# EAGLE design dynext_v1.1 (EAGLE 6.5.0)
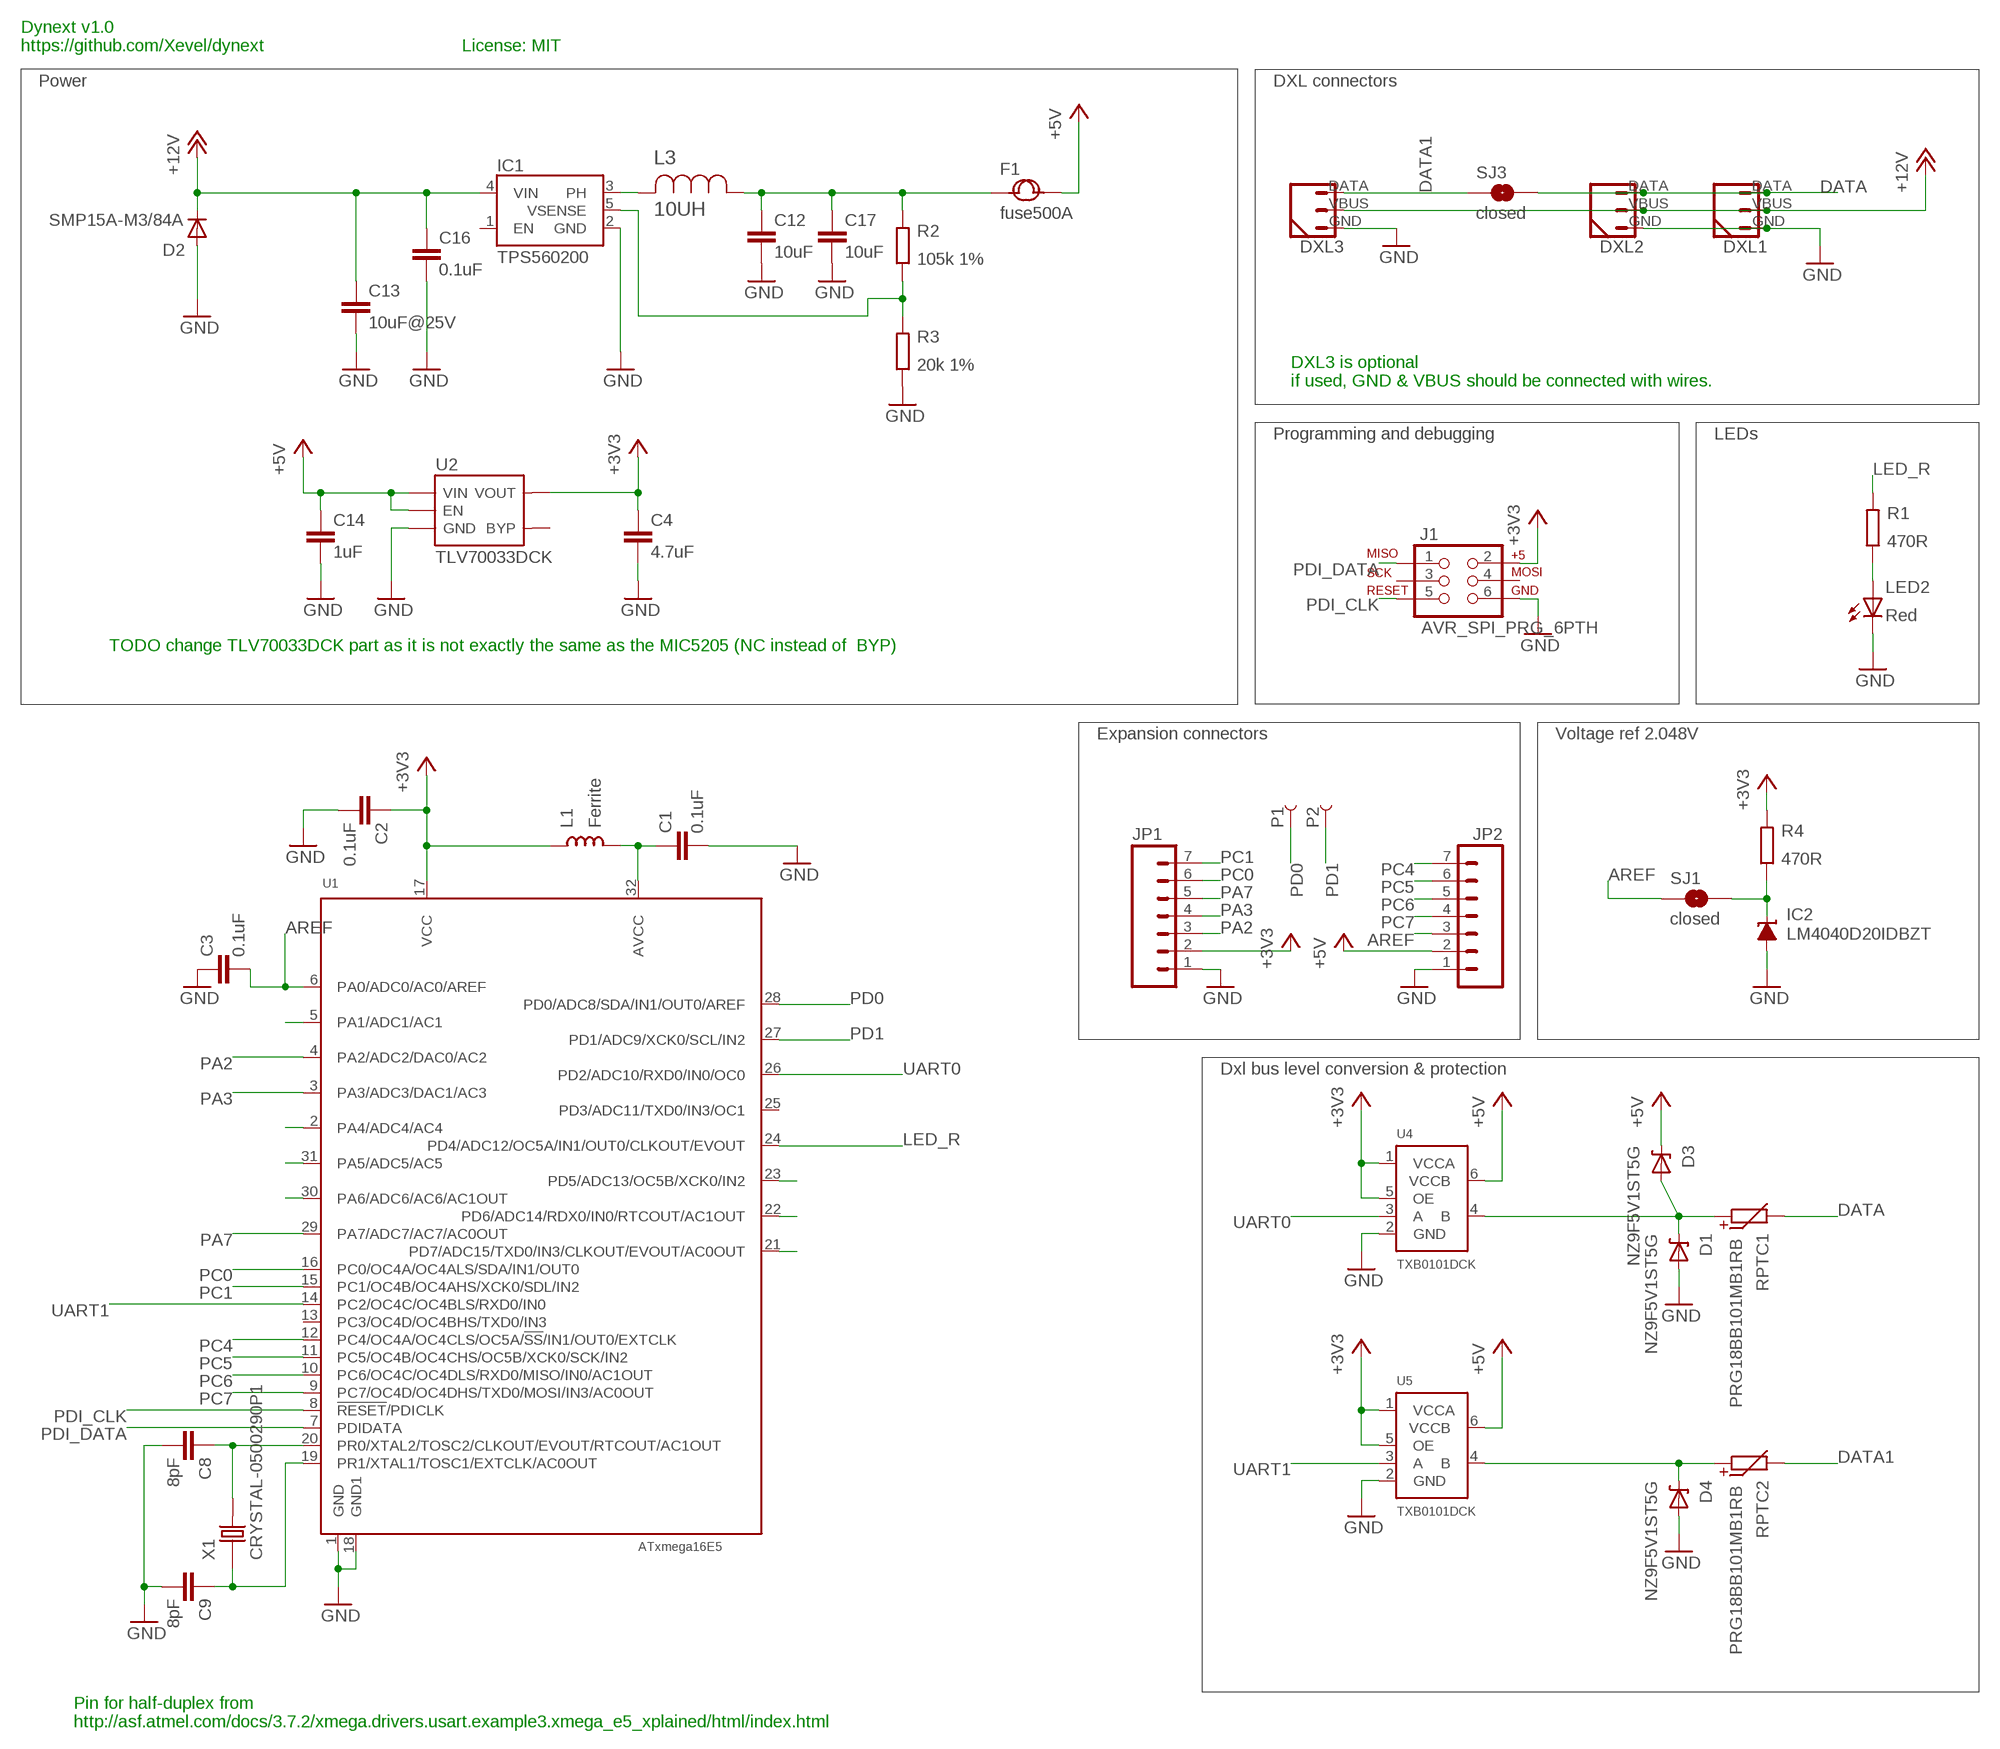
[diagram p0: schematic, sheet 1]

## Parts
C1  0.1uF  C0402  [0402_N]
C2  0.1uF  C0402  [0402_N]
C3  0.1uF  C0402  [0402_N]
C4  4.7uF  C0603  [0603_N]
C8  8pF  C0402  [0402_N]
C9  8pF  C0402  [0402_N]
C12  10uF  C0805  [0805_N]
C13  10uF@25V  C0805  [0805_N]
C14  1uF  C0402  [0402_N]
C16  0.1uF  C0402  [0402_N]
C17  10uF  C0805  [0805_N]
D1  NZ9F5V1ST5G  DIODE_ZENER-923  [SOD-923_N]
D2  SMP15A-M3/84A  DIODE-SMP  [DO-220AA]
D3  NZ9F5V1ST5G  DIODE_ZENER-923  [SOD-923_N]
D4  NZ9F5V1ST5G  DIODE_ZENER-923  [SOD-923_N]
DXL1  DYNAMIXEL_3POS-T  [DYNAMIXEL_3POS_TOP]
DXL2  DYNAMIXEL_3POS-T  [DYNAMIXEL_3POS_TOP]
DXL3  DYNAMIXEL_3POS-R  [DYNAMIXEL_3POS_RIGHT]
F1  fuse500A  FUSE-1206  [F1206]
IC1  TPS560200  IC_TPS560200  [SOT-23-5_N]
IC2  LM4040D20IDBZT  LM4041A12DBZ  [DBZ_R-PDSO-G3]
J1  AVR_SPI_PRG_6PTH  [2X3]
JP1  M07  [1X07]
JP2  M07  [1X07]
L1  Ferrite  L0603  [0603_N]
L3  10UH  ELL4LG100MA-4XG  [IND_ELL4XG]
LED2  Red  LED0603  [D_0603_N]
P1  PIN_SMD_2X2.5  [PIN_SMD_2X2.5]
P2  PIN_SMD_2X2.5  [PIN_SMD_2X2.5]
R1  470R  R0402  [0402_N]
R2  105k 1%  R0402  [0402_N]
R3  20k 1%  R0402  [0402_N]
R4  470R  R0402  [0402_N]
RPTC1  PRG18BB101MB1RB  R-PTC0603  [0603_N]
RPTC2  PRG18BB101MB1RB  R-PTC0603  [0603_N]
SJ1  closed  SOLDERJUMPER2_TRACE2  [SJ_2S-TRACE2]
SJ3  closed  SOLDERJUMPER2_TRACE2  [SJ_2S-TRACE2]
U1  ATxmega16E5  ATXMEGAE5-MU_MOD  [QFN-32_50P_L_MOD]
U2  TLV70033DCK  MIC5205-3.3YM5  [SC70-5]
U4  TXB0101DCK  [SC70-6]
U5  TXB0101DCK  [SC70-6]
X1  CRYSTAL-0500290P1  [2P-SMD-5.0X3.2]

## Nets
+3V3: C2.1 C4.1 J1.2 JP1.2 L1.1 R4.2 U1.17(VCC) U2.5(VOUT) U4.1(VCCA) U4.5(OE) U5.1(VCCA) U5.5(OE)
+5V: C14.1 D3.C F1.2 JP2.2 U2.1(VIN) U2.3(EN) U4.6(VCCB) U5.6(VCCB)
+12V: C13.1 C16.1 D2.C DXL1.VBUS DXL2.VBUS DXL3.VBUS IC1.4(VIN)
AREF: C3.2 JP2.3 SJ1.1 U1.6(PA0/ADC0/AC0/AREF)
DATA: DXL1.DATA DXL2.DATA RPTC1.2 SJ3.2
DATA1: DXL3.DATA RPTC2.2 SJ3.1
GND: C1.2 C2.2 C3.1 C4.2 C8.2 C9.2 C12.2 C13.2 C14.2 C16.2 C17.2 D1.A D2.A D4.A DXL1.GND DXL2.GND DXL3.GND IC1.2(GND) IC2.2(A) J1.6 JP1.1 JP2.1 LED2.C R3.1 U1.1(GND) U1.18(GND1) U2.2(GND) U4.2(GND) U5.2(GND)
LED_R: R1.2 U1.24(PD4/ADC12/OC5A/IN1/OUT0/CLKOUT/EVOUT)
N$2: C1.1 L1.2 U1.32(AVCC)
N$3: LED2.A R1.1
N$4: C8.1 U1.20(PR0/XTAL2/TOSC2/CLKOUT/EVOUT/RTCOUT/AC1OUT) X1.2
N$6: C9.1 U1.19(PR1/XTAL1/TOSC1/EXTCLK/AC0OUT) X1.1
N$7: D1.C D3.A RPTC1.1 U4.4(B)
N$8: U1.5(PA1/ADC1/AC1)
N$9: U1.2(PA4/ADC4/AC4)
N$10: U1.31(PA5/ADC5/AC5)
N$11: D4.C RPTC2.1 U5.4(B)
N$12: U1.30(PA6/ADC6/AC6/AC1OUT)
N$13: U1.21(PD7/ADC15/TXD0/IN3/CLKOUT/EVOUT/AC0OUT)
N$14: C12.1 C17.1 F1.1 L3.1 R2.2
N$15: IC1.5(VSENSE) R2.1 R3.2
N$16: U1.22(PD6/ADC14/RDX0/IN0/RTCOUT/AC1OUT)
N$17: U1.23(PD5/ADC13/OC5B/XCK0/IN2)
N$29: IC2.1(C) R4.1 SJ1.2
PA2: JP1.3 U1.4(PA2/ADC2/DAC0/AC2)
PA3: JP1.4 U1.3(PA3/ADC3/DAC1/AC3)
PA7: JP1.5 U1.29(PA7/ADC7/AC7/AC0OUT)
PC0: JP1.6 U1.16(PC0/OC4A/OC4ALS/SDA/IN1/OUT0)
PC1: JP1.7 U1.15(PC1/OC4B/OC4AHS/XCK0/SDL/IN2)
PC4: JP2.7 U1.12(PC4/OC4A/OC4CLS/OC5A/!SS!/IN1/OUT0/EXTCLK)
PC5: JP2.6 U1.11(PC5/OC4B/OC4CHS/OC5B/XCK0/SCK/IN2)
PC6: JP2.5 U1.10(PC6/OC4C/OC4DLS/RXD0/MISO/IN0/AC1OUT)
PC7: JP2.4 U1.9(PC7/OC4D/OC4DHS/TXD0/MOSI/IN3/AC0OUT)
PD0: P1.PIN U1.28(PD0/ADC8/SDA/IN1/OUT0/AREF)
PD1: P2.PIN U1.27(PD1/ADC9/XCK0/SCL/IN2)
PDI_CLK: J1.5 U1.8(!RESET!/PDICLK)
PDI_DATA: J1.1 U1.7(PDIDATA)
PH_L: IC1.3(PH) L3.2
UART0: U1.26(PD2/ADC10/RXD0/IN0/OC0) U4.3(A)
UART1: U1.14(PC2/OC4C/OC4BLS/RXD0/IN0) U5.3(A)
Unconnected: IC1.1(EN) J1.3 J1.4 U1.13(PC3/OC4D/OC4BHS/TXD0/IN3) U1.25(PD3/ADC11/TXD0/IN3/OC1) U2.4(BYP)

## Notes on the sheet
- Dynext v1.0
  https://github.com/Xevel/dynext
- License: MIT
- Power | DXL connectors
- DXL3 is optional 
  if used, GND & VBUS should be connected with wires.
- Programming and debugging | LEDs
- TODO change TLV70033DCK part as it is not exactly the same as the MIC5205 (NC instead of  BYP)
- Expansion connectors | Voltage ref 2.048V
- Dxl bus level conversion & protection
- Pin for half-duplex from 
  http://asf.atmel.com/docs/3.7.2/xmega.drivers.usart.example3.xmega_e5_xplained/html/index.html

## Library data of the parts
C1-C4 C8 C9 C12-C14 C16 C17 = Xevelabs:C: Non-polarized Capacitor
D1 D3 D4 = Xevelabs:DIODE_ZENER: Zener Diode
D2 = Xevelabs:DIODE: Diode
DXL1-DXL3 = Xevelabs:DYNAMIXEL_3POS
F1 = OPL:FUSE*
IC1 = Xevelabs:IC_TPS560200
IC2 = texas:LM4041: PRECISION MICROPOWER SHUNT VOLTAGE REFERENCE Source: http://focus.ti.com/lit/ds/slcs146e/slcs146e.pdf; MPN: LM4041A12IDBZR; OC_FARNELL: 1407949; OC_NEWARK: 58K5875
J1 = SparkFun-Connectors:AVR_SPI_PRG_6: AVR ISP 6 Pin This is the reduced ISP connector for AVR programming. Common on Arduino. This footprint will take up less PCB space and can be used with a 10-pin to 6-pin adapter such as SKU: BOB-08508
JP1 JP2 = SparkFun-Connectors:M07: Header 7 Standard 7-pin 0.1" header. Use with straight break away headers (SKU : PRT-00116), right angle break away headers (PRT-00553), swiss pins (PRT-00743), machine pins (PRT-00117), and female headers (PRT-00115). NOTES ON THE VARIANTS LOCK and LOCK_LONGPADS... This footprint was designed to help hold the alignment of a through-hole component (i.e. 7-pin header) while soldering it into place. You may notice that each hole has been shifted either up or down by 0.005 of an inch from it's more standard position (which is usually a perfectly straight line). This slight alteration caused the pins (the squares in the middle) to touch the edges of the holes. Because they are alternating, it causes a "brace" to hold the header in place. 0.005 has proven to be the perfect amount of "off-center" position when using our standard breakaway headers. Although looks a little odd when you look at the bare footprint, once you have a header in there, the alteration is very hard to notice. Also, if you push a header all the way into place, it is covered up entirely on the bottom side. This idea of altering the position of holes to aid alignment will be further integrated into the Sparkfun Library for other footprints. It can help hold any component with 3 or more connection pins.
L1 = Xevelabs:L
L3 = Panasonic-ELL:ELL: Choke Coils; MPN: ELL4LG100MA; OC_FARNELL: 1717444; OC_NEWARK: 15R1065; PACKAGE-SIZE: 3.8X3.8X1.8MM; SUPPLIER: PANASONIC
LED2 = Xevelabs:LED: LED
P1 P2 = Xevelabs:PIN
R1-R4 = Xevelabs:R: Resistor
RPTC1 RPTC2 = Xevelabs:R-PTC: PTC (Positive Temperature Coefficient) Resistor
SJ1 SJ3 = Xevelabs:SOLDERJUMPER2: Solder Jumper Standard SMD solder jumper. Used to automate production. Two varients : Normally Open and Normally Closed are the same, but have different paste layers. NC will have a large amount of paste and should jumper during reflow.
U1 = dynext_v0.1:ATXMEGAE5
U2 = OPL:MIC5205-3.3YM5: The MIC5205 is an efficient linear voltage regulator with ultra-low-noise output, very low dropout voltage (typically 17mV at light loads and 165mV at 150mA), and very low ground current (600µA at 100mA output). The MIC5205 offers better than 1% initial accuracy. datasheet here: http://www.micrel.com/product-info/prod/5205.shtml
U4 U5 = MWquad_stuff:TXB0101
X1 = OPL:CRYSTAL*

## Board
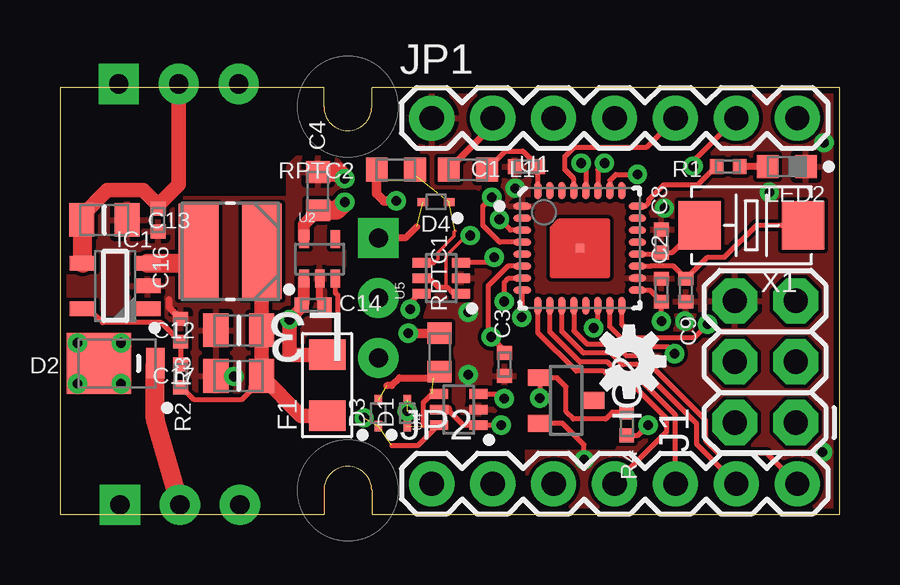
[diagram p1: board, top side]
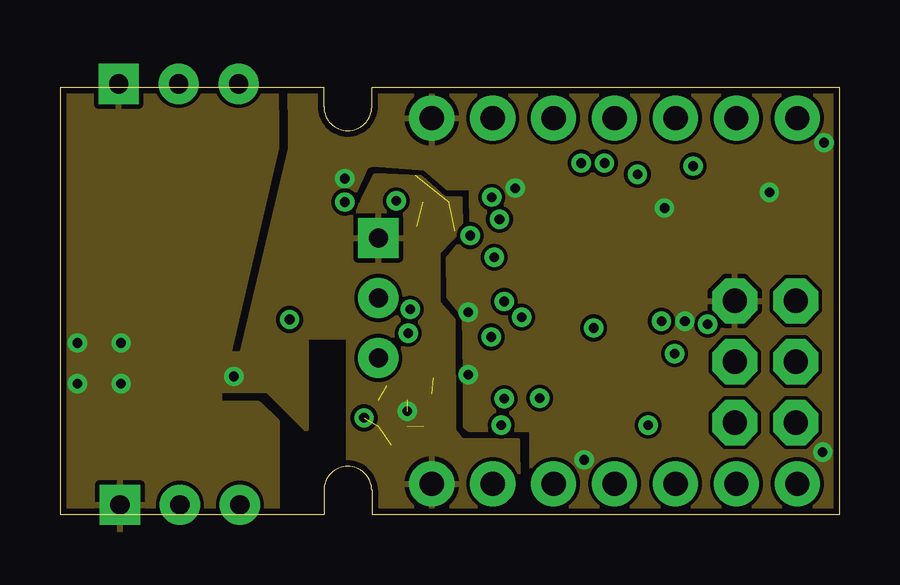
[diagram p2: board, inner layer GND]
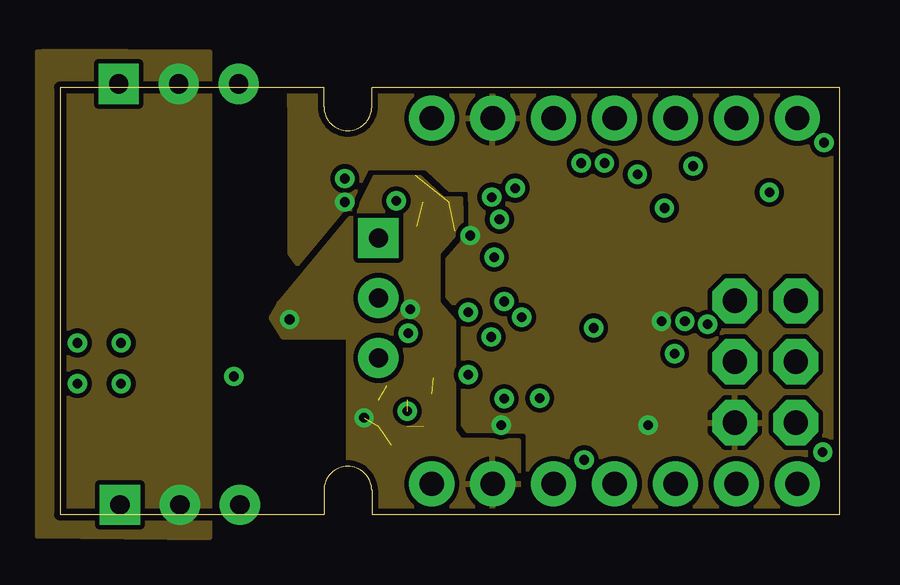
[diagram p3: board, inner layer POWER]
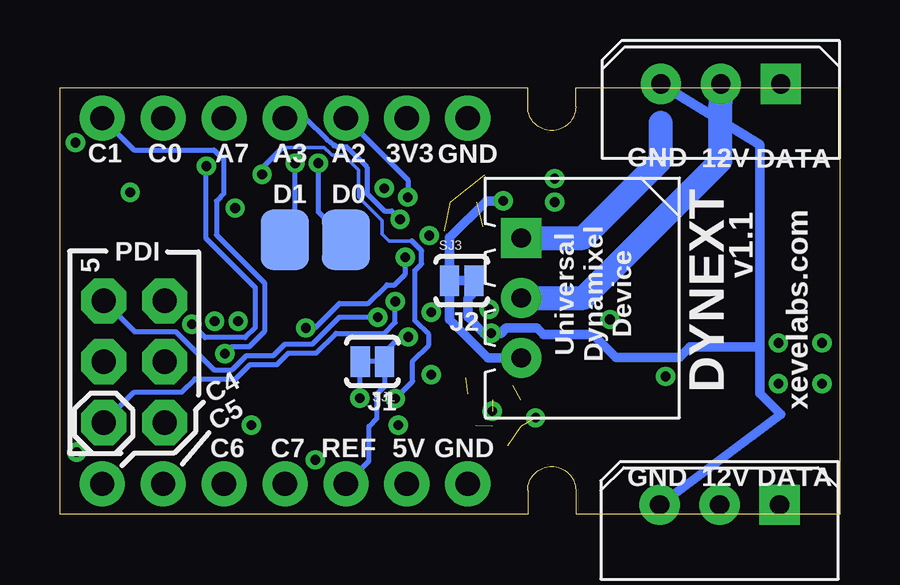
[diagram p4: board, bottom side, seen from below]

Size 32.5 x 17.8 mm. Coordinates in mm from the lower left corner, seen from the top.
Outline: 0,0 11,0 11,1 arc-180 13,1 13,0 32.5,0 32.5,17.8 13,17.8 13,17 arc-180 11,17 11,17.8 0,17.8 0,0
Copper layers (1*2*3*16): Top 0.035mm / dielectric 0.15mm / GND 0.035mm / dielectric 1.1mm / POWER 0.035mm / dielectric 0.15mm / Bottom 0.035mm
Design rules "Xevelabs_6mil_4layers_eurocircuits *": minimum track width 0.15mm, minimum drill 0.25mm, track to track 0.155mm, track to pad 0.155mm, pad to pad 0.155mm, via to via 0.155mm, smd to smd 0mil, copper to edge 0.25mm, drill to drill 0.25mm, minimum pad ring 0.15mm, minimum via ring 0.2mm, stop-mask expansion 0mil, vias tented up to drill 100mil, thermal gap 0.2mm
tRestrict: area 19.1,2.8 to 23.1,6.7

### Footprints (pad centres in the part's own frame; a part is rotated, then mirrored left to right if it is on the bottom)
0402_N = smd 0.57 x 0.62: 1 -0.48,0; 2 0.48,0
0603_N = smd 0.9 x 1: 1 -0.8,0; 2 0.8,0
0805_N = smd 1.05 x 1.4: 1 -0.95,0; 2 0.95,0
SOD-923_N = smd 0.43 x 0.32: A 0.55,0; C -0.55,0
DO-220AA = smd 2.67 x 2.54: A 0.7,0 | smd 0.76 x 1.27: C -1.65,0
DYNAMIXEL_3POS_TOP = drill 0.8 pad 1.676: DATA 0,-5; VBUS 0,-2.5 | drill 0.8 pad 1.676 square: GND 0,0
DYNAMIXEL_3POS_RIGHT = drill 0.8 pad 1.676: DATA 0,-5; VBUS 0,-2.5 | drill 0.8 pad 1.676 square: GND 0,0
F1206 = smd 1.27 x 1.524: 1 -1.27,0; 2 1.27,0
SOT-23-5_N = smd 1.1 x 0.6: 1 -1.35,0.95; 2 -1.35,0; 3 -1.35,-0.95; 4 1.35,-0.95; 5 1.35,0.95
DBZ_R-PDSO-G3 = smd 0.7 x 1: 1 -0.95,-1.1; 2 0.95,-1.1; 3 0,1.1
2X3 = drill 1.016 pad 1.88 octagon: 1 0,0; 2 0,2.54; 3 2.54,0; 4 2.54,2.54; 5 5.08,0; 6 5.08,2.54
1X07 = drill 1.016 pad 1.88: 1 0,0; 2 2.54,0; 3 5.08,0; 4 7.62,0; 5 10.16,0; 6 12.7,0; 7 15.24,0
IND_ELL4XG = smd 1.651 x 3.988: 1 -1.321,0; 2 1.321,0
D_0603_N = smd 0.9 x 0.95: A 0.8,0; C -0.8,0
PIN_SMD_2X2.5 = smd 2.5 x 2: PIN 0,0
SJ_2S-TRACE2 = smd 0.8 x 1.27: 1 -0.508,0; 2 0.508,0
QFN-32_50P_L_MOD = smd 0.75 x 0.3: 1 -2.4,1.75; 2 -2.4,1.25; 3 -2.4,0.75; 4 -2.4,0.25; 5 -2.4,-0.25; 6 -2.4,-0.75; 7 -2.4,-1.25; 8 -2.4,-1.75; 17 2.4,-1.75; 18 2.4,-1.25; 19 2.4,-0.75; 20 2.4,-0.25; 21 2.4,0.25; 22 2.4,0.75; 23 2.4,1.25; 24 2.4,1.75 | smd 0.3 x 0.75: 9 -1.75,-2.4; 10 -1.25,-2.4; 11 -0.75,-2.4; 12 -0.25,-2.4; 13 0.25,-2.4; 14 0.75,-2.4; 15 1.25,-2.4; 16 1.75,-2.4; 25 1.75,2.4; 26 1.25,2.4; 27 0.75,2.4; 28 0.25,2.4; 29 -0.25,2.4; 30 -0.75,2.4; 31 -1.25,2.4; 32 -1.75,2.4 | smd 0.35 x 0.35: 33 0,0
SC70-5 = smd 0.4 x 0.75: 1 -0.65,-0.825; 2 0,-0.825; 3 0.65,-0.825; 4 0.65,0.825; 5 -0.65,0.825
SC70-6 = smd 0.4 x 0.75: 1 -0.65,-0.825; 2 0,-0.825; 3 0.65,-0.825; 4 0.65,0.825; 5 0,0.825; 6 -0.65,0.825
2P-SMD-5.0X3.2 = smd 1.778 x 2.032: 1 -2.159,0; 2 2.159,0

### Placement (x,y rotation side)
C1  19.45,14.5 180 top
C2  25.07,9.35 90 top
C3  18.52,6.25 90 top
C4  10.75,13.47 90 top
C8  25.07,11.4 90 top
C9  26.1,9.35 270 top
C12  7.45,7.67 180 top
C13  1.85,12.28 0 top
C14  10.55,8.72 0 top
C16  4.1,12.28 270 top
C17  7.45,5.78 180 top
D1  14.47,4.22 90 top
D2  2.33,6.3 180 top
D3  13.28,4.22 90 top
D4  15.68,13.03 180 top
DXL1  2.45,17.95 90 top
DXL2  2.5,0.4 90 top
DXL3  13.28,11.53 0 bottom
F1  11.14,5.38 90 top
IC1  2.3,9.53 180 top
IC2  21.1,4.75 270 top
J1  30.68,3.83 90 top
JP1  15.5,16.52 0 top
JP2  15.5,1.27 0 top
L1  17,14.38 0 top
L3  7.1,10.97 180 top
LED2  30.3,14.5 180 top
P1  20.57,11.45 270 bottom
P2  23.12,11.45 90 bottom
R1  27.85,14.5 180 top
R2  5.03,5.78 270 top
R3  5.03,7.67 270 top
R4  23.62,3.77 270 top
RPTC1  15.82,6.75 90 top
RPTC2  14,14.38 180 top
SJ1  19.48,6.38 180 bottom
SJ3  15.75,9.75 0 bottom
U1  21.68,11.1 0 top
U2  10.82,10.65 0 top
U4  16.62,4.38 90 top
U5  15.9,9.85 90 top
U$1  [OSHW-LOGO-S]  23.73,6.38 270 top
X1  28.82,12.05 180 top

### Tracks (layer width: path | path; a pad name or v marks a point on that pad's centre or on a via)
+3V3  (via drill 0.4)
  Top 0.15: v17.1,11.62 16.95,11.62 16.1,10.78 16.1,9.53 16.15,9.47
  Top 0.2: 16.15,4.38 16.8,3.73 U4.1 v18.4,3.73 | v25.07,8.05 C2.1 24.59,9.35 U1.17 | R4.2 24.09,3.29 v24.52,3.73 | U5.5 15.38,9.85 15.75,9.47 16.15,9.47 16.43,9.2 U5.1
  Top 0.3: L1.1 18.04,16.21 JP1.2
  Top 0.4: U4.5 16.15,4.38
  Top 0.5: U2.5 10.18,12.1 C4.1
  Top 0.8: v11.88,13.03 11.53,12.68 C4.1
  pour POWER (isolate 0.2, rank 5): 9.57,18.65 36.02,19.07 38.73,-0.55 18.2,-0.97 9.6,10.85 9.6,15.3
+5V  (via drill 0.4)  (2 unrouted)
  Top 0.2: U2.3 11.47,9.25 11.57,9.15 11.57,7.09 F1.2 | 13.82,2.88 14.93,2.88 15.78,3.73 U4.6 15.65,3.73 | v14.6,8.55 14.6,8.82 14.97,9.2 U5.6
  Top 0.5: v9.57,8.12 10.07,8.62 C14.1 10.18,8.83 U2.1
  Top 0.6: F1.2 9.57,6.66 v9.57,8.12
  other vias: 12.68,4.03
  pour POWER (isolate 0.2, rank 4): 19.12,-0.17 19.12,3.08 16.7,3.1 16.43,3.48 16.43,8.07 15.78,8.82 15.78,10.9 16.75,12.03 16.73,13.15 15.97,13.15 15,14.05 13.12,14.07 12.55,12.93 9.12,8.8 8.78,8.2 9.28,7.4 12,7.4 12,0
+12V
  Top 0.6: 0.95,12.22 C13.1 0.9,12.45 1.98,13.53 3.48,13.53 4.1,12.9 | 4.1,12.9 4.95,13.75 DXL1.VBUS | 4.1,12.9 C16.1
  Top 0.8: IC1.4 0.95,12.22 | DXL2.VBUS 3.98,3.98 D2.C
  Bottom 1: DXL3.VBUS 10.68,9.03 4.97,14.72 4.97,16.27 DXL1.VBUS
  pour POWER (isolate 0.2, no thermals): -0.95,19.27 -0.95,-0.9 6.25,-0.97 6.25,19.27 -0.57,19.32
AREF  (via drill 0.4)
  Top 0.2: U1.6 18.68,10.35 17.85,9.53 17.85,7.53 v17.98,7.4 18.52,6.85 C3.2
  Bottom 0.2: JP2.3 19.62,2.23 19.62,3.67 19.3,4 19.3,5 18.97,5.33 SJ1.1 | SJ1.1 18.97,6.3 | v17.98,7.4 18.32,7.4 18.88,6.85 18.88,6.57 18.97,6.47 SJ1.1
DATA  (via drill 0.4)
  Top 0.4: v14.53,7.55 RPTC1.2
  Bottom 0.4: DXL2.DATA 2.45,4.17 3.33,5.05 3.33,6.97 | SJ3.2 15.24,9.26 15.5,9 15.5,8.22 14.82,7.55 v14.53,7.55 14.12,7.55 13.9,7.78 12.62,7.78 12.35,7.5 10.28,7.5 9.32,6.55 6.67,6.55 6.25,6.97 3.33,6.97 | 3.33,6.97 3.33,15.43 DXL1.DATA
DATA1  (via drill 0.4)
  Top 0.4: v14.03,13.07 13.5,13.07 13.2,13.38 RPTC2.2
  Bottom 0.4: DXL3.DATA 14.65,6.53 16.26,8.13 SJ3.1 16.26,11.54 14.72,13.07 v14.03,13.07
GND  (via drill 0.4)  (2 unrouted)
  Top 0.2: 20.32,3.8 IC2.2 20.95,3.8 21.85,2.9 v21.85,2.27
  Top 0.3: 4.55,8.95 4.55,8.63 R3.1 | C14.2 10.82,8.93 U2.2 | 14.88,12 14.4,11.53 DXL3.GND
  Top 0.4: D2.A 0.78,5.45 v0.72,5.45
  Top 0.8: C4.2 11.6,14.28 v11.88,14
  Bottom 1: DXL3.GND 10.7,11.53 7.45,14.78 7.45,16.32
  other vias: 0.72,7.15 2.55,5.45 2.55,7.15 7.25,5.75 14.47,4.3 17.02,5.83 18.98,13.6 25.2,12.78 26.05,8.05 17.02,8.43 29.57,13.43 31.85,15.5 31.8,2.6
  pour GND: -0.53,-0.62 9.07,-0.62 9.07,3.85 8.28,4.62 6.67,4.62 6.67,5.15 8.65,5.17 10.28,3.55 10.28,7.4 12,7.4 12,-0.62 19.12,-0.47 19.1,3.08 16.75,3.08 16.43,3.5 16.4,8.1 15.78,8.82 15.78,10.95 16.73,11.93 16.7,13.15 16,13.18 15.03,14.05 13.12,14.12 12.65,13.15 12.53,12.85 12.15,12.97 12.2,13.25 12.78,14.53 13.03,14.6 15.22,14.45 16.15,13.62 17.12,13.6 17.15,11.9 16.18,10.68 16.2,9.07 16.85,8.28 16.88,5.85 16.88,3.7 17.05,3.55 19.65,3.55 19.62,-0.6 32.98,-0.38 33.2,18.32 9.57,18.5 9.6,15.22 7.58,6.7 7.05,6.7 9.05,15.32 9.03,18.43 -0.38,18.43
  pour Top: -0.23,13.18 -0.25,7.8 4.35,7.9 4.33,4.75 9.55,5.15 9.53,13.2
  pour Top (rank 2): 11.43,14.88 11.82,14.47 11.82,8.1 11.55,7.08 9.8,6.8 9.53,8.72 9.53,14.5 9.9,14.88
  pour Top: 16.5,6.35 16.25,5.92 16.3,4.45 16.93,3.52 19.45,3.48 19.55,-0.5 40.77,-0.35 37.67,19.82 13.9,18.82 15.57,13.68 17.48,13.62 17.48,11.15 16.2,11.1 15.22,8.2 16.45,8.12
LED_R
  Top 0.2: U1.24 24.4,12.85 24.55,13 24.55,13.12 25.18,13.75 26.6,13.75 27.35,14.5 R1.2
N$2
  Top 0.2: U1.32 C1.1 19.93,14.52 19.3,15.15 18.57,15.15 L1.2
N$3
  Top 0.3: LED2.A R1.1
N$4
  Top 0.2: U1.20 25,10.85 C8.1 25.54,10.92 X1.2
N$5
  Bottom 0.4: 15.47,9.75 16,9.75
N$6
  Top 0.2: X1.1 29.02,12.05 27.7,10.72 27,10.72 C9.1 25.55,10.38 24.65,10.38 24.62,10.35 U1.19
N$7  (3 unrouted)
  Top 0.2: 15.15,3.7 15.15,4.67 15.5,5.03 U4.4
  Top 0.3: 13.62,5.38 13.82,5.38 14.15,5.7 15.57,5.7 RPTC1.1
N$11  (2 unrouted)
  Top 0.15: 15.57,10.5 15.6,10.5 15.75,10.65 15.75,10.93 16.43,11.6 16.43,11.78 16.48,11.82
  Top 0.2: 15.57,10.5 U5.4
  Top 0.3: RPTC2.1 14.8,14.15
N$14
  Top 0.2: R2.2 5.08,5.29 5.58,4.8 7.6,4.8 7.97,5.17 7.97,5.35 C17.1
  Top 0.6: L3.1 8.4,10.95 C12.1 C17.1 10.06,4.12 F1.1
N$15
  Top 0.2: R2.1 R3.2 4.22,8 1.77,8 1.2,8.57 IC1.5
N$29  (via drill 0.4)
  Top 0.2: R4.1 23.03,4.25 22.75,3.98 21.4,3.98 21.1,4.28 21.1,5.33 20.73,5.7 IC2.1 v20,4.85
  Bottom 0.2: v20,4.85 20,6.36 SJ1.2
PA2  (via drill 0.4)
  Top 0.2: U1.4 18.32,11.35 17.62,12.05 17.62,12.85 v18,13.22
  Bottom 0.2: JP1.3 18,13.95 v18,13.22
PA3  (via drill 0.4)
  Top 0.2: U1.3 18.77,11.85 v18.32,12.3
  Bottom 0.2: JP1.4 22.27,16.52 21.35,15.6 21.25,15.53 21.07,15.38 21,15.38 20.95,15.32 20.55,15.32 19.7,14.47 19.7,13.38 18.98,12.65 18.68,12.65 v18.32,12.3
PA7
  Top 0.2: U1.29 21.43,14 21.05,14.38 21.05,14.93 21.45,15.32 24.46,15.32 JP1.5
PC0  (via drill 0.4)
  Top 0.2: JP1.6 26.4,14.72 v26.4,14.53 | U1.16 23.43,7.92 23.98,7.38 26.45,7.38 v27,7.92
  Bottom 0.2: v27,7.92 26.45,7.38 24.77,7.38 24.35,7.8 24.35,9.45 26.4,11.5 v26.4,14.53
PC1  (via drill 0.4)
  Top 0.2: U1.15 22.93,7.83 23.75,7 25.32,7 v25.62,6.7
  Bottom 0.2: JP1.7 29.41,15.2 26.07,15.2 25.68,14.8 25.68,13.38 25.98,13.07 25.98,11.65 23.98,9.65 23.98,7.62 24.6,7 25.32,7 v25.62,6.7
PC4
  Top 0.2: JP2.7 29.46,2.55 27.45,2.55 26.93,3.08 26.93,3.92 24.23,6.62 23.6,6.62 23.12,7.1 21.98,7.1 21.43,7.65 U1.12
PC5
  Top 0.2: JP2.6 26.55,2.92 26.55,3.77 24.07,6.25 23.45,6.25 22.98,6.72 21.82,6.72 20.93,7.62 U1.11
PC6
  Top 0.2: JP2.5 25.66,4.14 23.93,5.88 23.3,5.88 22.82,6.35 21.68,6.35 20.43,7.6 U1.10
PC7
  Top 0.2: JP2.4 25.3,3.46 25.3,3.98 23.77,5.5 23.15,5.5 22.68,5.97 21.52,5.97 19.93,7.58 U1.9
PD0  (via drill 0.4)
  Top 0.2: v21.73,14.65 21.93,14.45 U1.28
  Bottom 0.2: P1.PIN 21.73,12.6 v21.73,14.65
PD1  (via drill 0.4)
  Top 0.2: v22.7,14.65 22.43,14.38 U1.27
  Bottom 0.2: P2.PIN 22.7,11.88 v22.7,14.65
PDI_CLK  (via drill 0.4)
  Top 0.2: v19.25,8.22 19.27,8.25 U1.8
  Bottom 0.2: J1.5 29.39,7.62 27.68,7.62 26.07,6.03 25.32,6.03 24.73,6.62 23.6,6.62 23.12,7.1 21.98,7.1 20.85,8.22 v19.25,8.22
PDI_DATA  (via drill 0.4)
  Top 0.2: v18.52,8.88 18.52,9.68 18.7,9.85 U1.7
  Bottom 0.2: J1.1 29.4,5.1 27.43,5.1 26.88,5.65 25.18,5.65 24.57,6.25 23.45,6.25 22.98,6.72 21.82,6.72 21,7.55 18.98,7.55 18.52,8 v18.52,8.88
PH_L
  Top 0.6: 5.28,10.47 L3.2
  Top 0.8: IC1.3 5.28,10.47
UART0  (via drill 0.4)
  Top 0.2: v24.07,14.18 23.18,14.18 22.93,13.93 U1.26 | U4.3 18.32,5.03 v18.52,4.83
  Bottom 0.15: 23.23,15.3 21.5,15.3 21.25,15.07 21.15,14.97 20.68,14.97 20.05,14.35 20.05,13.22 19.07,12.25 19.07,11.7 18.77,11.4 17.82,11.4
  Bottom 0.2: v18.52,4.83 17.8,5.55 17.8,6.4 17.12,7.08 17.12,7.5 17.7,8.07 17.7,10.18 17.43,10.45 17.43,11 17.82,11.4 | v24.07,14.18 24.07,14.45 23.23,15.3
UART1  (via drill 0.4)
  Top 0.2: v22.25,7.78 22.43,7.95 U1.14 | v18.1,10.72 17.88,10.5 U5.3
  Bottom 0.2: v22.25,7.78 21.88,7.78 20.85,8.8 19.65,8.8 18.88,9.57 18.55,9.57 18.1,10.03 v18.1,10.72

### Text on the board
bPlace: DATA | 12V | GND | GND | 3V3 | A2 | A3 | A7 | C0 | C1 | D0 | D1 | PDI | v1.1 | 5 | Universal / Dynamixel / Device | J2 | C4 | DYNEXT | J1 | C5 | xevelabs.com | GND | 5V | REF | C7 | C6 | DATA | 12V | GND